# EasyEDA Pro project 通信+控制电路板.epro, schematic Schematic1
Board Name: Board1; Create Date: 2025-07-09; Page Name: P1; Project Name: 机器狗分电通信板; Schematic Name: Schematic1; Update Date: 2025-07-10; Company: 嘉立创EDA; Page Size: A4; Version: V1.0
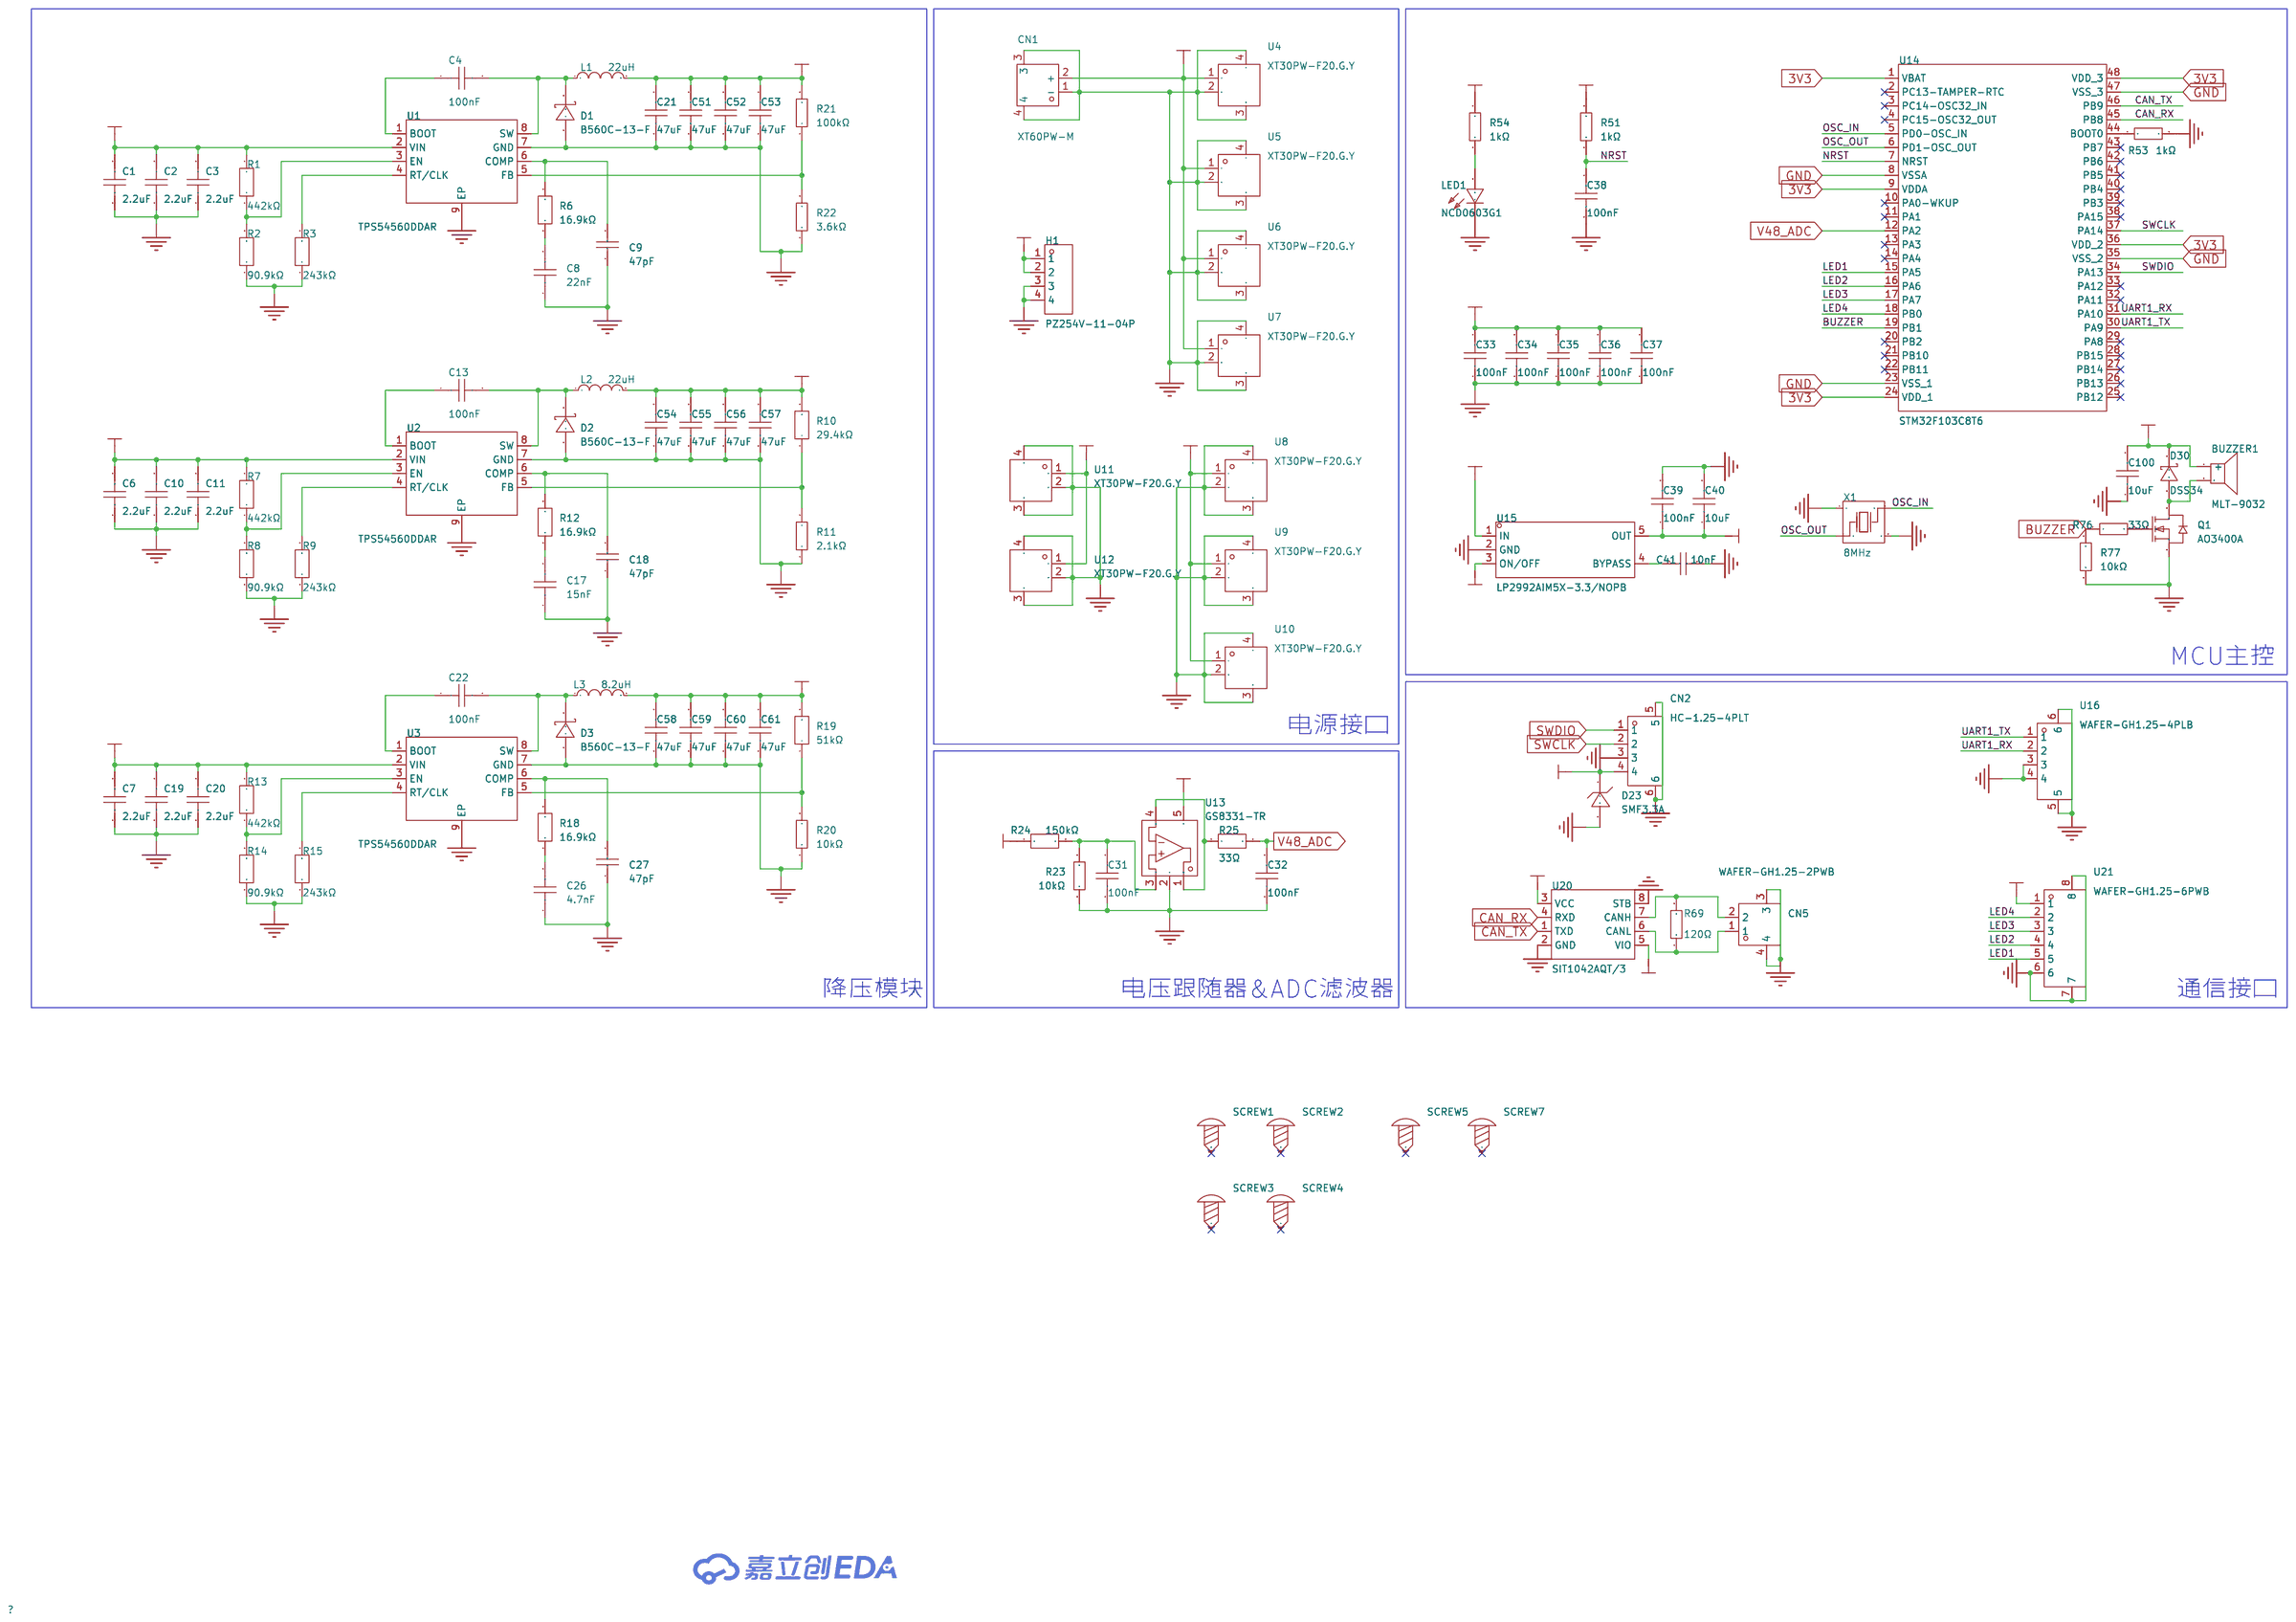
[diagram p0: schematic sheet]

## Parts
BUZZER1  MLT-9032  [BUZ-SMD_MLT-9032]
C1  2.2uF  [C1206]
C2  2.2uF  [C1206]
C3  2.2uF  [C1206]
C4  100nF  [C0603]
C6  2.2uF  [C1206]
C7  2.2uF  [C1206]
C8  22nF  [C0603]
C9  47pF  [C0603]
C10  2.2uF  [C1206]
C11  2.2uF  [C1206]
C13  100nF  [C0603]
C17  15nF  [C0603]
C18  47pF  [C0603]
C19  2.2uF  [C1206]
C20  2.2uF  [C1206]
C21  47uF  [C1206]
C22  100nF  [C0603]
C26  4.7nF  [C0603]
C27  47pF  [C0603]
C31  100nF  [C0603]
C32  100nF  [C0603]
C33  100nF  [C0603]
C34  100nF  [C0603]
C35  100nF  [C0603]
C36  100nF  [C0603]
C37  100nF  [C0603]
C38  100nF  [C0603]
C39  100nF  [C0603]
C40  10uF  [C0603]
C41  10nF  [C0603]
C51  47uF  [C1206]
C52  47uF  [C1206]
C53  47uF  [C1206]
C54  47uF  [C1206]
C55  47uF  [C1206]
C56  47uF  [C1206]
C57  47uF  [C1206]
C58  47uF  [C1206]
C59  47uF  [C1206]
C60  47uF  [C1206]
C61  47uF  [C1206]
C100  10uF  [C0603]
CN1  XT60PW-M  [CONN-TH_XT60PW-M]
CN2  HC-1.25-4PLT  [CONN-SMD_4P-P1.25_HCTL_HC-1.25-4PLT]
CN5  WAFER-GH1.25-2PWB  [CONN-TH_2P-P1.25_XUNPU_WAFER-GH1.25-2PWB]
D1  B560C-13-F  [SMC_L7.1-W6.2-LS8.1-RD]
D2  B560C-13-F  [SMC_L7.1-W6.2-LS8.1-RD]
D3  B560C-13-F  [SMC_L7.1-W6.2-LS8.1-RD]
D23  SMF3.3A  [SOD-123_L2.8-W1.8-LS3.7-RD]
D30  DSS34  [SOD-123FL_L2.7-W1.8-LS3.8-RD]
H1  PZ254V-11-04P  [HDR-TH_4P-P2.54-V-M]
L1  22uH  [IND-SMD_L10.7-W10.0_ETQP5MXXXX]
L2  22uH  [IND-SMD_L8.5-W8.0_XR0850]
L3  8.2uH  [IND-SMD_L7.0-W6.6_FXL0630]
LED1  NCD0603G1  [LED0603-RD_1]
Q1  AO3400A  [SOT-23_L2.9-W1.3-P1.90-LS2.4-BR]
R1  442kΩ  [R0603]
R2  90.9kΩ  [R0603]
R3  243kΩ  [R0603]
R6  16.9kΩ  [R0603]
R7  442kΩ  [R0603]
R8  90.9kΩ  [R0603]
R9  243kΩ  [R0603]
R10  29.4kΩ  [R0603]
R11  2.1kΩ  [R0603]
R12  16.9kΩ  [R0603]
R13  442kΩ  [R0603]
R14  90.9kΩ  [R0603]
R15  243kΩ  [R0603]
R18  16.9kΩ  [R0603]
R19  51kΩ  [R0603]
R20  10kΩ  [R0603]
R21  100kΩ  [R0603]
R22  3.6kΩ  [R0603]
R23  10kΩ  [R0603]
R24  150kΩ  [R0603]
R25  33Ω  [R0603]
R51  1kΩ  [R0603]
R53  1kΩ  [R0603]
R54  1kΩ  [R0603]
R69  120Ω  [R0603]
R76  33Ω  [R0603]
R77  10kΩ  [R0603]
SCREW1  -  [M2螺丝]
SCREW2  -  [M2螺丝]
SCREW3  -  [M2螺丝]
SCREW4  -  [M2螺丝]
SCREW5  -  [M2螺丝]
SCREW7  -  [M2螺丝]
U1  TPS54560DDAR  [SOP-8_L4.9-W3.9-P1.27-LS6.0-BL-EP-3]
U2  TPS54560DDAR  [SOP-8_L4.9-W3.9-P1.27-LS6.0-BL-EP-3]
U3  TPS54560DDAR  [SOP-8_L4.9-W3.9-P1.27-LS6.0-BL-EP-3]
U4  XT30PW-F20.G.Y  [CONN-TH_XT30PW-F-1]
U5  XT30PW-F20.G.Y  [CONN-TH_XT30PW-F-1]
U6  XT30PW-F20.G.Y  [CONN-TH_XT30PW-F-1]
U7  XT30PW-F20.G.Y  [CONN-TH_XT30PW-F-1]
U8  XT30PW-F20.G.Y  [CONN-TH_XT30PW-F-1]
U9  XT30PW-F20.G.Y  [CONN-TH_XT30PW-F-1]
U10  XT30PW-F20.G.Y  [CONN-TH_XT30PW-F-1]
U11  XT30PW-F20.G.Y  [CONN-TH_XT30PW-F-1]
U12  XT30PW-F20.G.Y  [CONN-TH_XT30PW-F-1]
U13  GS8331-TR  [SOT-23-5_L3.0-W1.7-P0.95-LS2.8-BL]
U14  STM32F103C8T6  [LQFP-48_L7.0-W7.0-P0.50-LS9.0-BL]
U15  LP2992AIM5X-3.3/NOPB  [SOT-23-5_L3.0-W1.7-P0.95-LS2.8-BR]
U16  WAFER-GH1.25-4PLB  [CONN-SMD_4P-P1.25_XUNPU_WAFER-GH1.25-4PLB]
U20  SIT1042AQT/3  [SOIC-8_L4.9-W3.9-P1.27-LS6.0-BL]
U21  WAFER-GH1.25-6PWB  [CONN-SMD_6P-P1.25_XUNPU_WAFER-GH1.25-6PWB]
X1  8MHz  [CRYSTAL-SMD_4P-L3.2-W2.5-BL]

## Library data of the parts
BUZZER1 = MLT-9032: Supplier Part: C194480; Manufacturer: 华能; JLCPCB Part Class: 扩展库; Datasheet: https://atta.szlcsc.com/upload/public/pdf/source/20231110/88E349EFBF67C090826D552D99A009CF.pdf; Supplier: LCSC
C1-C3 C6 C7 C10 C11 C19 C20 = CC1206KKX7R0BB225: 容值:2.2uF;精度:±10%;额定电压:100V;材质(温度系数):X7R;; LCSC Part Name: 2.2uF ±10% 100V; Supplier Part: C577211; Manufacturer: YAGEO(国巨); Supplier Footprint: 1206; JLCPCB Part Class: 扩展库; Datasheet: https://atta.szlcsc.com/upload/public/pdf/source/20211215/54859EBD0B88AE2AE5A42330F12918A3.pdf; Supplier: LCSC; Tolerance: ±10%; Voltage Rated: 100V; Temperature Coefficient: X7R
C4 C13 C22 = CGA0603X7R104K500JT: 容值:100nF;精度:±10%;额定电压:50V;温度系数:X7R;; LCSC Part Name: 100nF ±10% 50V; Supplier Part: C6119867; Manufacturer: HRE(芯声); Supplier Footprint: 0603; JLCPCB Part Class: 扩展库; Datasheet: https://atta.szlcsc.com/upload/public/pdf/source/20250103/C44077DA9E7B3EFAE02F22B6D3D1CBC9.pdf; Supplier: LCSC; Tolerance: ±10%; Voltage Rating: 50V; Temperature Coefficient: X7R
C8 C17 C26 = CGA0603X7R472K500JT: 容值:4.7nF;精度:±10%;额定电压:50V;温度系数:X7R;; LCSC Part Name: 4.7nF ±10% 50V; Supplier Part: C7503499; Manufacturer: HRE(芯声); Supplier Footprint: 0603; JLCPCB Part Class: 扩展库; Supplier: LCSC; Tolerance: ±10%; Voltage Rating: 50V; Temperature Coefficient: X7R
C9 C18 C27 = CC0603JRNPO9BN470: 容值:47pF;精度:±5%;额定电压:50V;材质(温度系数):NP0;; LCSC Part Name: 47pF ±5% 50V; Supplier Part: C105622; Manufacturer: YAGEO(国巨); Supplier Footprint: 0603; JLCPCB Part Class: 扩展库; Datasheet: https://atta.szlcsc.com/upload/public/pdf/source/20170505/1493957838062.pdf; Supplier: LCSC; Tolerance: ±5%; Voltage Rated: 50V; Temperature Coefficient: NP0
C21 C51-C61 = HGC1206R5476M250NSPJ: 容值:47uF;精度:±20%;额定电压:25V;温度系数:X5R;; LCSC Part Name: 47uF ±20% 25V; Supplier Part: C22367835; Manufacturer: Chinocera(华瓷); Supplier Footprint: 1206; JLCPCB Part Class: 扩展库; Datasheet: https://atta.szlcsc.com/upload/public/pdf/source/20240326/E6CB0DC43BB858B74F4352229FABFDCA.pdf; Supplier: LCSC; Tolerance: ±20%; Voltage Rating: 25V; Temperature Coefficient: X5R
C31-C39 = CC0603KRX7R9BB104: 容值:100nF;精度:±10%;额定电压:50V;温度系数:X7R;; LCSC Part Name: 100nF ±10% 50V; Supplier Part: C14663; Manufacturer: YAGEO(国巨); Supplier Footprint: 0603; JLCPCB Part Class: 基础库; Datasheet: https://atta.szlcsc.com/upload/public/pdf/source/20180910/C282072_33301C7F631E79921B82A8DAC6BCC5B3.pdf; Supplier: LCSC; Tolerance: ±10%; Voltage Rating: 50V; Temperature Coefficient: X7R
C40 = CGA0603X5R106K100JT: 容值:10uF;精度:±10%;额定电压:10V;温度系数:X5R;; LCSC Part Name: 10uF ±10% 10V; Supplier Part: C6119842; Manufacturer: HRE(芯声); Supplier Footprint: 0603; JLCPCB Part Class: 扩展库; Supplier: LCSC; Tolerance: ±10%; Voltage Rating: 10V; Temperature Coefficient: X5R
C41 = CC0603KRX7R9BB103: 容值:10nF;精度:±10%;额定电压:50V;材质(温度系数):X7R;; LCSC Part Name: 10nF ±10% 50V; Supplier Part: C100042; Manufacturer: YAGEO(国巨); Supplier Footprint: 0603; JLCPCB Part Class: 扩展库; Datasheet: https://atta.szlcsc.com/upload/public/pdf/source/20181008/C309510_22F155564471FAF6A489F7D68F34234E.pdf; Supplier: LCSC; Tolerance: ±10%; Voltage Rated: 50V; Temperature Coefficient: X7R
C100 = CGA0603X5R106K100JT: 容值:10uF;精度:±10%;额定电压:10V;温度系数:X5R;; LCSC Part Name: 10uF ±10% 10V; Supplier Part: C6119842; Manufacturer: HRE(芯声); Supplier Footprint: 0603; JLCPCB Part Class: 扩展库; Supplier: LCSC; Tolerance: ±10%; Voltage Rating: 10V; Temperature Coefficient: X5R; Voltage Rated: 10V
CN1 = XT60PW-M: 类别:-;类型1:-;; LCSC Part Name: AMASS(艾迈斯)航模插头xt60连接器150公母对接pw锂电池公头 板插卧式XT60PW-M; Supplier Part: C98732; Manufacturer: AMASS(艾迈斯); JLCPCB Part Class: 扩展库; Datasheet: https://atta.szlcsc.com/upload/public/pdf/source/20240118/44A3DCFF53BE25DC65378AFFB21277A4.pdf; Supplier: LCSC; Type: 卧式插头; Colour: 黄色; InterfaceType: 公头
CN2 = HC-1.25-4PLT: 插针结构:1x4P;间距:1.25mm;安装方式:立贴;参考系列:PicoBlade(MX 1.25);总PIN数:4P;排数:1;每排PIN数:4;行距:-;额定电流:2A;触头材质:黄铜;触头镀层:锡;工作温度范围:-25℃~+85℃;; LCSC Part Name: 1x4P 间距:1.25mm 立贴 系列:PicoBlade(MX 1.25); Supplier Part: C2845390; Manufacturer: HCTL(华灿天禄); Supplier Footprint: SMD,P=1.25mm; JLCPCB Part Class: 扩展库; Datasheet: https://atta.szlcsc.com/upload/public/pdf/source/20230707/8E5913B5A3195C18F5EE12EA4CB86B82.pdf; Supplier: LCSC; Pins Structure: 1x4P; Pitch: 1.25mm; Mounting Style: 立贴; Reference Series: PicoBlade(MX 1.25); Number of Pins: 4P; Number of Rows: 1; Number of PINs Per Row: 4; Current Rating (Max): 2A; Contact Material: 黄铜; Contact Plating: 锡; Operating Temperature Range: -25℃~+85℃; Rated Voltage (Max): 250V; Plastic Material: LCP; Flame Retardant Rating: UL94V-0; Supplementary Features: 辅助焊脚; Z-Height of the Board: 4.75mm; X-Length of Bottom Edge on Board (Spacing Line): 9.8mm; Y-Width of Bottom Edge on Board: 4.2mm
CN5 = WAFER-GH1.25-2PWB: 插针结构:1x2P;间距:1.25mm;安装方式:卧贴;参考系列:GH;总PIN数:2P;排数:1;每排PIN数:2;行距:-;额定电流:1A;触头材质:黄铜;触头镀层:-;工作温度范围:-25℃~+85℃;; LCSC Part Name: 1x2P 间距:1.25mm 卧贴 系列:GH; Supplier Part: C3029377; Manufacturer: XUNPU(讯普); Supplier Footprint: SMD,P=1.25mm,卧贴; JLCPCB Part Class: 扩展库; Datasheet: https://atta.szlcsc.com/upload/public/pdf/source/20220527/CB8773BFB0913C3B8ABD62CB38BA101A.pdf; Supplier: LCSC; Pins Structure: 1x2P; Pitch: 1.25mm; Mounting Type: 卧贴; Reference Series: GH; Number of Pins: 2P; Number of Rows: 1; Number of PINs Per Row: 2; Current Rating: 1A; Contact Material: 黄铜; Operating Temperature: -25℃~+85℃; Voltage Rating: 125V; Plastic Material: LCP; Supplementary Features: 辅助焊脚; Color: 米色; Z-Height of the Board: 4.35mm; X-Length of Bottom Edge on Board (Spacing Line): 5.75mm; Y-Width of Bottom Edge on Board: 5mm
D1-D3 = B560C-13-F: 正向压降(Vf):700mV@5A;直流反向耐压(Vr):60V;整流电流:5A;; LCSC Part Name: 电压:60V 电流:5A; Supplier Part: C85100; Manufacturer: DIODES(美台); Supplier Footprint: SMC(DO-214AB); JLCPCB Part Class: 扩展库; Datasheet: https://atta.szlcsc.com/upload/public/pdf/source/20171023/C134461_15087453602301052556.pdf; Supplier: LCSC; Forward Voltage (Vf@If): 700mV@5A; Reverse Voltage (Vr): 60V; Rectified Current: 5A; Reverse Leakage Current (Ir): 500uA@60V
D23 = SMF3.3A_C283866: 反向截止电压(Vrwm):3.3V;最大钳位电压:8V;峰值脉冲电流(Ipp)@10/1000us:25A;击穿电压:5.2V;; Supplier Part: C283866; Manufacturer: DOWO(东沃); Supplier Footprint: SOD-123FL; JLCPCB Part Class: 扩展库; Datasheet: https://atta.szlcsc.com/upload/public/pdf/source/20240321/1BA336232F2D97E4B026619682DB80D3.pdf; Supplier: LCSC; Reverse Stand-Off Voltage (Vrwm): 3.3V; Maximum Clamping Voltage: 8V; Peak Pulse Current (Ipp)@10/1000us: 25A; Breakdown Voltage: 5.2V; Reverse Leakage Current (Ir): 600uA; Type: TVS
D30 = DSS34_C511866: 正向压降(Vf):550mV@3A;直流反向耐压(Vr):40V;整流电流:3A;; LCSC Part Name: 电压:40V 电流:3A; Supplier Part: C511866; Manufacturer: BORN(伯恩半导体); Supplier Footprint: SOD-123FL; JLCPCB Part Class: 扩展库; Datasheet: https://atta.szlcsc.com/upload/public/pdf/source/20231213/A35D7F17905BC063B6E854915CEDE7F7.pdf; Supplier: LCSC; Forward Voltage (Vf@If): 550mV@3A; Reverse Voltage (Vr): 40V; Rectified Current: 3A
H1 = PZ254V-11-04P: 插针结构:1x4P;间距:2.54mm;行距:-;圆针/方针:方针;安装类型:直插;排数:单排;总PIN位数:4P;额定电流:3A;额定电压:250V;配合针长度:6mm;塑高:2.5mm;端接针长度:3mm;触头材质:-;工作温度范围:-40℃~+105℃;颜色:黑色;; LCSC Part Name: 间距:2.54mm 1x4P 直插 方针; Supplier Part: C2691448; Manufacturer: XFCN(兴飞); Supplier Footprint: 插件,P=2.54mm; JLCPCB Part Class: 扩展库; Datasheet: https://atta.szlcsc.com/upload/public/pdf/source/20200309/C492403_F9F19131791D08044AD4F84F8E751A34.pdf; Supplier: LCSC; Pin Structure: 1x4P; Pitch: 2.54mm; Circluar Pins/Square Pins: 方针; Mounting Type: 直插; Number of Rows: 单排; Number of Pins: 4P; Current Rating (Max): 3A; Voltage Rating (Max): 250V; Length of Mating Pin: 6mm; Insulation Height: 2.5mm; Length of End Connection Pin: 3mm; Operating Temperature Range: -40℃~+105℃; Color: 黑色
L1 = ETQP5M220YFC: 电感值:22uH;精度:±20%;额定电流:5.2A;饱和电流(Isat):8.8A;类型:一体成型电感;; LCSC Part Name: 22uH ±20% 8.8A; Supplier Part: C409633; Manufacturer: PANASONIC(松下); Supplier Footprint: SMD,10.7x10mm; JLCPCB Part Class: 扩展库; Datasheet: https://atta.szlcsc.com/upload/public/pdf/source/20190806/C409633_A24DBB89846E72786399C70D6ADBEB8A.pdf; Supplier: LCSC; Tolerance: ±20%; Rated Current: 5.2A; Saturation Current (Isat): 8.8A; DC Resistance (DCR): 45mΩ; Type: 一体成型电感; Ratings: AEC-Q200
L2 = CPX0850-220M-AG(22UH): 电感值:22uH;精度:±20%;额定电流:4.5A;饱和电流(Isat):6.5A;类型:一体成型电感;; LCSC Part Name: 22uH ±20% 6.5A; Supplier Part: C7461739; Manufacturer: DMBJ(振宝佳); Supplier Footprint: SMD,D8.5xL8.0mm; JLCPCB Part Class: Extended Part; Datasheet: https://atta.szlcsc.com/upload/public/pdf/source/20230706/0E85B4C70C3BF12A3691AC2C75FD94BE.pdf; Supplier: LCSC; Tolerance: ±20%; Current Rating: 4.5A; Current - Saturation(Isat): 6.5A; DC Resistance(DCR): 82mΩ; Type: 一体成型电感
L3 = FXL0630-8R2-M: 电感值:8.2uH;精度:±20%;额定电流:5A;饱和电流(Isat):6A;类型:一体成型电感;; LCSC Part Name: 8.2uH ±20% 6A; Supplier Part: C167222; Manufacturer: cjiang(长江微电); Supplier Footprint: SMD,6.6x7mm; JLCPCB Part Class: 扩展库; Datasheet: https://atta.szlcsc.com/upload/public/pdf/source/20240426/3189EA8206330E2108542F9E34E540E7.pdf; Supplier: LCSC; Tolerance: ±20%; Rated Current: 5A; Saturation Current (Isat): 6A; DC Resistance (DCR): 60mΩ; Type: 一体成型电感
LED1 = NCD0603G1: 发光颜色:翠绿色;正向压降(Vf):2.6V~3.6V;功率:72mW;正向电流:20mA;波长:515nm~530nm;透镜颜色:-;发光强度:330mcd~900mcd;发光角度:130°;工作温度:-30℃~+85℃;; Supplier Part: C84267; Manufacturer: 国星光电; Supplier Footprint: 0603; JLCPCB Part Class: 扩展库; Datasheet: https://atta.szlcsc.com/upload/public/pdf/source/20200820/C84267_04BA7703640BAC111D09F5EFB971FBF3.pdf; Supplier: LCSC; Illumination Color: 翠绿色; Voltage - Forward(Vf): 2.6V~3.6V; Power(Watts): 72mW; Forward Current: 20mA; Wavelength - Dominant: 515nm~530nm; Luminous Intensity: 330mcd~900mcd; Viewing Angle: 130°; Operating Temperature: -30℃~+85℃
Q1 = AO3400A_C344010: 类型:1个N沟道;漏源电压(Vdss):30V;连续漏极电流(Id):5.8A;导通电阻(RDS(on)@Vgs,Id):32mΩ@10V,5.8A;功率(Pd):1.4W;阈值电压(Vgs(th)@Id):1.4V@250uA;; LCSC Part Name: 1个N沟道 耐压:30V 电流:5.8A; Supplier Part: C344010; Manufacturer: BORN(伯恩半导体); Supplier Footprint: SOT-23; JLCPCB Part Class: 扩展库; Datasheet: https://atta.szlcsc.com/upload/public/pdf/source/20181211/C344010_1A88330921524F88534EF594457919E8.pdf; Supplier: LCSC; Type: 1个N沟道; Drain Source Voltage (Vdss): 30V; Continuous Drain Current (Id): 5.8A; Drain Source On Resistance (RDS(on)@Vgs,Id): 32mΩ@10V,5.8A; Power Dissipation (Pd): 1.4W; Gate Threshold Voltage (Vgs(th)@Id): 1.4V@250uA; Input Capacitance (Ciss@Vds): 823pF@15V; Operating Temperature: -55℃~+150℃
R1 R7 R13 = FRH0603D4423TS: 电阻类型:厚膜电阻;阻值:442kΩ;精度:±0.5%;功率:100mW;最大工作电压:75V;温度系数:±100ppm/℃;; LCSC Part Name: 442kΩ ±0.5% 100mW 厚膜电阻; Supplier Part: C3013343; Manufacturer: FOJAN(富捷); Supplier Footprint: 0603; JLCPCB Part Class: 扩展库; Datasheet: https://atta.szlcsc.com/upload/public/pdf/source/20211221/925EC7D7225764EE0046F22065062C87.pdf; Supplier: LCSC; Type: 厚膜电阻; Tolerance: ±0.5%; Power(Watts): 100mW; Overload Voltage (Max): 75V; Temperature Coefficient: ±100ppm/℃
R2 R8 R14 = FRC0603F9092TS: 电阻类型:厚膜电阻;阻值:90.9kΩ;精度:±1%;功率:100mW;工作电压:75V;温度系数:±100ppm/℃;; LCSC Part Name: 90.9kΩ ±1% 100mW 厚膜电阻; Supplier Part: C2930136; Manufacturer: FOJAN(富捷); Supplier Footprint: 0603; JLCPCB Part Class: 扩展库; Datasheet: https://atta.szlcsc.com/upload/public/pdf/source/20211221/925EC7D7225764EE0046F22065062C87.pdf; Supplier: LCSC; Type: 厚膜电阻; Tolerance: ±1%; Power(Watts): 100mW; Voltage-Supply(Max): 75V; Temperature Coefficient: ±100ppm/℃; Operating Temperature: -55℃~+155℃
R3 R9 R15 = FRC0603F2433TS: 电阻类型:厚膜电阻;阻值:243kΩ;精度:±1%;功率:100mW;温度系数:±100ppm/℃;; LCSC Part Name: 厚膜电阻 243kΩ ±1% 100mW; Supplier Part: C7467321; Manufacturer: FOJAN(富捷); Supplier Footprint: 0603; JLCPCB Part Class: 扩展库; Datasheet: https://atta.szlcsc.com/upload/public/pdf/source/20211221/9022FBEBBD509006A57EBC43C1F2F40C.pdf; Supplier: LCSC; Type: 厚膜电阻; Tolerance: ±1%; Power(Watts): 100mW; Temperature Coefficient: ±100ppm/℃
R6 R12 R18 = FRC0603F1692TS: 电阻类型:厚膜电阻;阻值:16.9kΩ;精度:±1%;功率:100mW;工作电压:75V;温度系数:±100ppm/℃;; LCSC Part Name: 16.9kΩ ±1% 100mW 厚膜电阻; Supplier Part: C2933158; Manufacturer: FOJAN(富捷); Supplier Footprint: 0603; JLCPCB Part Class: 扩展库; Datasheet: https://atta.szlcsc.com/upload/public/pdf/source/20211221/925EC7D7225764EE0046F22065062C87.pdf; Supplier: LCSC; Type: 厚膜电阻; Tolerance: ±1%; Power(Watts): 100mW; Voltage-Supply(Max): 75V; Temperature Coefficient: ±100ppm/℃; Operating Temperature: -55℃~+155℃
R10 = FRC0603F2942TS: 电阻类型:厚膜电阻;阻值:29.4kΩ;精度:±1%;功率:100mW;工作电压:75V;温度系数:±100ppm/℃;; LCSC Part Name: 29.4kΩ ±1% 100mW 厚膜电阻; Supplier Part: C2930086; Manufacturer: FOJAN(富捷); Supplier Footprint: 0603; JLCPCB Part Class: 扩展库; Datasheet: https://atta.szlcsc.com/upload/public/pdf/source/20211221/925EC7D7225764EE0046F22065062C87.pdf; Supplier: LCSC; Type: 厚膜电阻; Tolerance: ±1%; Power(Watts): 100mW; Voltage-Supply(Max): 75V; Temperature Coefficient: ±100ppm/℃; Operating Temperature: -55℃~+155℃
R11 = RT0603BRD072K1L: 电阻类型:薄膜电阻;阻值:2.1kΩ;精度:±0.1%;功率:100mW;温度系数:±25ppm/℃;; LCSC Part Name: 薄膜电阻 2.1kΩ ±0.1% 100mW; Supplier Part: C861293; Manufacturer: YAGEO(国巨); Supplier Footprint: 0603; JLCPCB Part Class: 扩展库; Datasheet: https://atta.szlcsc.com/upload/public/pdf/source/20200610/C326738_5639A9F1B6EB6E4AE2197577D3456E7F.pdf; Supplier: LCSC; Type: 薄膜电阻; Tolerance: ±0.1%; Power(Watts): 100mW; Temperature Coefficient: ±25ppm/℃; Operating Temperature Range: -55℃~+155℃
R19 = FRC0603F5362TS: 电阻类型:厚膜电阻;阻值:53.6kΩ;精度:±1%;功率:100mW;最大工作电压:75V;温度系数:±100ppm/℃;; LCSC Part Name: 53.6kΩ ±1% 100mW 厚膜电阻; Supplier Part: C2930115; Manufacturer: FOJAN(富捷); Supplier Footprint: 0603; JLCPCB Part Class: 扩展库; Datasheet: https://atta.szlcsc.com/upload/public/pdf/source/20211221/925EC7D7225764EE0046F22065062C87.pdf; Supplier: LCSC; Type: 厚膜电阻; Tolerance: ±1%; Power(Watts): 100mW; Overload Voltage (Max): 75V; Temperature Coefficient: ±100ppm/℃; Operating Temperature Range: -55℃~+155℃
R20 = 0603WAF1002T5E: 电阻类型:厚膜电阻;阻值:10kΩ;精度:±1%;功率:100mW;工作电压:75V;温度系数:±100ppm/℃;; LCSC Part Name: 厚膜电阻 10kΩ ±1% 100mW; Supplier Part: C25804; Manufacturer: UNI-ROYAL(厚声); Supplier Footprint: 0603; JLCPCB Part Class: 基础库; Datasheet: https://atta.szlcsc.com/upload/public/pdf/source/20200306/C422600_1E6D84923E4A46A82E41ADD87F860B5C.pdf; Supplier: LCSC; Type: 厚膜电阻; Tolerance: ±1%; Power(Watts): 100mW; Voltage-Supply(Max): 75V; Temperature Coefficient: ±100ppm/℃; Operating Temperature: -55℃~+155℃
R21 = 0603WAF1003T5E: 电阻类型:厚膜电阻;阻值:100kΩ;精度:±1%;功率:100mW;最大工作电压:75V;温度系数:±100ppm/℃;; LCSC Part Name: 100kΩ ±1% 100mW 厚膜电阻; Supplier Part: C25803; Manufacturer: UNI-ROYAL(厚声); Supplier Footprint: 0603; JLCPCB Part Class: 基础库; Datasheet: https://atta.szlcsc.com/upload/public/pdf/source/20200306/C422600_1E6D84923E4A46A82E41ADD87F860B5C.pdf; Supplier: LCSC; Type: 厚膜电阻; Tolerance: ±1%; Power(Watts): 100mW; Overload Voltage (Max): 75V; Temperature Coefficient: ±100ppm/℃; Operating Temperature Range: -55℃~+155℃
R22 = 0603WAF3301T5E: 电阻类型:厚膜电阻;阻值:3.3kΩ;精度:±1%;功率:100mW;最大工作电压:75V;温度系数:±100ppm/℃;; LCSC Part Name: 3.3kΩ ±1% 100mW 厚膜电阻; Supplier Part: C22978; Manufacturer: UNI-ROYAL(厚声); Supplier Footprint: 0603; JLCPCB Part Class: 基础库; Datasheet: https://atta.szlcsc.com/upload/public/pdf/source/20200306/C422600_1E6D84923E4A46A82E41ADD87F860B5C.pdf; Supplier: LCSC; Type: 厚膜电阻; Tolerance: ±1%; Power(Watts): 100mW; Overload Voltage (Max): 75V; Temperature Coefficient: ±100ppm/℃; Operating Temperature Range: -55℃~+155℃
R23 = RT0603BRD0710KL: 电阻类型:薄膜电阻;阻值:10kΩ;精度:±0.1%;功率:100mW;最大工作电压:75V;温度系数:±25ppm/℃;; LCSC Part Name: 薄膜电阻 10kΩ ±0.1% 100mW; Supplier Part: C95204; Manufacturer: YAGEO(国巨); Supplier Footprint: 0603; JLCPCB Part Class: 扩展库; Datasheet: https://atta.szlcsc.com/upload/public/pdf/source/20170217/1487301593756.pdf; Supplier: LCSC; Type: 薄膜电阻; Tolerance: ±0.1%; Power(Watts): 100mW; Overload Voltage (Max): 75V; Temperature Coefficient: ±25ppm/℃; Operating Temperature Range: -55℃~+155℃
R24 = ERA3AEB154V: 电阻类型:薄膜电阻;阻值:150kΩ;精度:±0.1%;功率:100mW;最大工作电压:75V;温度系数:±25ppm/℃;; LCSC Part Name: 150kΩ ±0.1% 100mW 薄膜电阻; Supplier Part: C473258; Manufacturer: PANASONIC(松下); Supplier Footprint: 0603; JLCPCB Part Class: 扩展库; Datasheet: https://atta.szlcsc.com/upload/public/pdf/source/20200407/C473258_86C691EA00C291CD14859B4B15974633.pdf; Supplier: LCSC; Type: 薄膜电阻; Tolerance: ±0.1%; Power(Watts): 100mW; Overload Voltage (Max): 75V; Temperature Coefficient: ±25ppm/℃; Operating Temperature Range: -55℃~+155℃
R25 = FRC0603F33R0TS: 电阻类型:厚膜电阻;阻值:33Ω;精度:±1%;功率:100mW;最大工作电压:75V;温度系数:±100ppm/℃;; LCSC Part Name: 33Ω ±1% 100mW 厚膜电阻; Supplier Part: C2909394; Manufacturer: FOJAN(富捷); Supplier Footprint: 0603; JLCPCB Part Class: 扩展库; Datasheet: https://atta.szlcsc.com/upload/public/pdf/source/20211221/925EC7D7225764EE0046F22065062C87.pdf; Supplier: LCSC; Type: 厚膜电阻; Tolerance: ±1%; Power(Watts): 100mW; Overload Voltage (Max): 75V; Temperature Coefficient: ±100ppm/℃; Operating Temperature Range: -55℃~+155℃
R51 R53 R54 = 0603WAF1001T5E: 电阻类型:厚膜电阻;阻值:1kΩ;精度:±1%;功率:100mW;最大工作电压:75V;温度系数:±100ppm/℃;; LCSC Part Name: 1kΩ ±1% 100mW 厚膜电阻; Supplier Part: C21190; Manufacturer: UNI-ROYAL(厚声); Supplier Footprint: 0603; JLCPCB Part Class: 基础库; Datasheet: https://atta.szlcsc.com/upload/public/pdf/source/20200306/C422600_1E6D84923E4A46A82E41ADD87F860B5C.pdf; Supplier: LCSC; Type: 厚膜电阻; Tolerance: ±1%; Power(Watts): 100mW; Overload Voltage (Max): 75V; Temperature Coefficient: ±100ppm/℃; Operating Temperature Range: -55℃~+155℃
R69 = 0603WAF1200T5E: 电阻类型:厚膜电阻;阻值:120Ω;精度:±1%;功率:100mW;最大工作电压:75V;温度系数:±100ppm/℃;; LCSC Part Name: 120Ω ±1% 100mW 厚膜电阻; Supplier Part: C22787; Manufacturer: UNI-ROYAL(厚声); Supplier Footprint: 0603; JLCPCB Part Class: 基础库; Datasheet: https://atta.szlcsc.com/upload/public/pdf/source/20200306/C422600_1E6D84923E4A46A82E41ADD87F860B5C.pdf; Supplier: LCSC; Type: 厚膜电阻; Tolerance: ±1%; Power(Watts): 100mW; Overload Voltage (Max): 75V; Temperature Coefficient: ±100ppm/℃; Operating Temperature Range: -55℃~+155℃
R76 = 0603WAF330JT5E: 电阻类型:厚膜电阻;阻值:33Ω;精度:±1%;功率:100mW;最大工作电压:75V;温度系数:±100ppm/℃;; LCSC Part Name: 33Ω ±1% 100mW 厚膜电阻; Supplier Part: C23140; Manufacturer: UNI-ROYAL(厚声); Supplier Footprint: 0603; JLCPCB Part Class: 基础库; Datasheet: https://atta.szlcsc.com/upload/public/pdf/source/20200306/C422600_1E6D84923E4A46A82E41ADD87F860B5C.pdf; Supplier: LCSC; Type: 厚膜电阻; Tolerance: ±1%; Power(Watts): 100mW; Overload Voltage (Max): 75V; Temperature Coefficient: ±100ppm/℃; Operating Temperature Range: -55℃~+155℃
R77 = 0603WAF1002T5E: 电阻类型:厚膜电阻;阻值:10kΩ;精度:±1%;功率:100mW;工作电压:75V;温度系数:±100ppm/℃;; LCSC Part Name: 厚膜电阻 10kΩ ±1% 100mW; Supplier Part: C25804; Manufacturer: UNI-ROYAL(厚声); Supplier Footprint: 0603; JLCPCB Part Class: 基础库; Datasheet: https://atta.szlcsc.com/upload/public/pdf/source/20200306/C422600_1E6D84923E4A46A82E41ADD87F860B5C.pdf; Supplier: LCSC; Type: 厚膜电阻; Tolerance: ±1%; Power(Watts): 100mW; Voltage-Supply(Max): 75V; Temperature Coefficient: ±100ppm/℃; Operating Temperature: -55℃~+155℃; Overload Voltage (Max): 75V; Operating Temperature Range: -55℃~+155℃
SCREW1-SCREW5 SCREW7 = M2螺丝: Supplier Footprint: 插件
U1-U3 = TPS54560DDAR_C7420431: 功能类型:降压型;输出类型:可调;工作电压:4.5V~60V;输出电压:800mV~57V;输出电流:5A;; LCSC Part Name: 4.5V-60V输入，5A输出，高效降压DC-DC转换器; Supplier Part: C7420431; Manufacturer: Tokmas(托克马斯); Supplier Footprint: SOP-8-EP; JLCPCB Part Class: 扩展库; Datasheet: https://atta.szlcsc.com/upload/public/pdf/source/20230612/0697A5E7B050616939B6E65FB5217F67.pdf; Supplier: LCSC; Function: 降压型; Output Type: 可调; Voltage - Supply: 4.5V~60V; Output Voltage: 800mV~57V; Output Current: 5A; Frequency - Switching: 450kHz; Operating Temperature: -40℃~+125℃@(TJ); Synchronous Rectifier: 否; Number of Outputs: 1; Topology: 降压式；反相式; Quiescent Current: 175uA; Switch tube (built-in/external): 内置
U4-U12 = XT30PW-F20.G.Y: 类别:-;类型1:-;; LCSC Part Name: AMASS(艾迈斯)电源连接器 母头 XT30PW-F; Supplier Part: C2913282; Manufacturer: AMASS(艾迈斯); JLCPCB Part Class: 扩展库; Datasheet: https://atta.szlcsc.com/upload/public/pdf/source/20231218/06CFCF98887A9A87638B0856A725C8FD.pdf; Supplier: LCSC; Type: 航模插头; InterfaceType: 母头
U13 = GS8331-TR: 放大器数:单路;增益带宽积(GBP):350kHz;压摆率(SR):0.2V/us;; LCSC Part Name: GS8331 SOT-23-5; Supplier Part: C157712; Manufacturer: Gainsil(聚洵); Supplier Footprint: SOT-23-5; JLCPCB Part Class: 扩展库; Datasheet: https://atta.szlcsc.com/upload/public/pdf/source/20200615/C605419_D70E1851DA800D34ADA08E397521FED7.pdf; Supplier: LCSC; Number of Circuits: 单路; Gain Bandwidth Product(GBP): 350kHz; Slew Rate(SR): 0.2V/us; Supply Voltage: 2.1V~5.5V; Supply Current: 20uA; Operating Temperature: -40℃~+125℃
U14 = STM32F103C8T6: CPU内核:ARM-M3;CPU最大主频:72MHz;应用领域:-;; LCSC Part Name: 主流增强型ARM Cortex-M3 MCU，具有64 KB Flash、72 MHz CPU、电机控制、USB和CAN; Supplier Part: C8734; Manufacturer: ST(意法半导体); Supplier Footprint: LQFP-48(7x7); JLCPCB Part Class: 扩展库; Datasheet: https://atta.szlcsc.com/upload/public/pdf/source/20220812/8363ACEC51AD55ECEB84799464F7CB85.pdf; Supplier: LCSC; CPU Core: ARM-M3; CPU Maximum Speed: 72MHz; Program Storage Size: 64KB; Program Memory Type: FLASH; Number of I/O: 37; ADC (Bit): 12bit; Voltage - Supply: 2V~3.6V
U15 = LP2992AIM5X-3.3/NOPB: 输出类型:固定;最大输入电压:16V;输出电压:3.3V;输出电流:250mA;电源纹波抑制比(PSRR):45dB@(1kHz);输出极性:正极;; LCSC Part Name: 具有使能功能的 250mA、16V、低压降稳压器; Supplier Part: C111076; Manufacturer: TI(德州仪器); Supplier Footprint: SOT-23-5; JLCPCB Part Class: 扩展库; Datasheet: https://www.ti.com/cn/lit/gpn/lp2992; Supplier: LCSC; Output Type: 固定; Maximum Input Voltage: 16V; Output Voltage: 3.3V; Output Current: 250mA; Power Supply Rejection Ratio (PSRR): 45dB@(1kHz); Dropout Voltage: 850mV@(250mA); standby current: 95uA; Feature: 防静电保护；短路保护；低ESR；热保护(TSD)；过流保护(OCP)；带使能; Operating Temperature: -40℃~+125℃; Output Polarity: 正极; Number of Outputs: 1
U16 = WAFER-GH1.25-4PLB: 插针结构:1x4P;间距:1.25mm;安装方式:立贴;参考系列:GH;总PIN数:4P;排数:1;每排PIN数:4;行距:-;额定电流:1A;触头材质:黄铜;触头镀层:-;工作温度范围:-25℃~+85℃;; LCSC Part Name: 1x4P 间距:1.25mm 立贴 系列:GH; Supplier Part: C3029370; Manufacturer: XUNPU(讯普); Supplier Footprint: SMD,P=1.25mm; JLCPCB Part Class: 扩展库; Datasheet: https://atta.szlcsc.com/upload/public/pdf/source/20220527/44F824AAC8C2B617205E15955FF9C23D.pdf; Supplier: LCSC; Pins Structure: 1x4P; Pitch: 1.25mm; Mounting Type: 立贴; Reference Series: GH; Number of Pins: 4P; Number of Rows: 1; Number of PINs Per Row: 4; Current Rating: 1A; Contact Material: 黄铜; Operating Temperature: -25℃~+85℃; Voltage Rating: 125V; Plastic Material: LCP; Supplementary Features: 辅助焊脚; Color: 米色; Z-Height of the Board: 4.2mm; X-Length of Bottom Edge on Board (Spacing Line): 8.25mm; Y-Width of Bottom Edge on Board: 4.95mm
U20 = SIT1042AQT/3: 类型:CAN-FD收发器;数据速率:5Mbps;; Supplier Part: C5382542; Manufacturer: SIT(芯力特); Supplier Footprint: SOP-8; JLCPCB Part Class: 扩展库; Datasheet: https://atta.szlcsc.com/upload/public/pdf/source/20240906/D3430A363AE1D9ADB7ADD9C550EC5EB2.pdf; Supplier: LCSC; Type: CAN-FD收发器; Data Rate: 5Mbps; Supply Voltage: 4.5V~5.5V
U21 = WAFER-GH1.25-6PWB: 插针结构:1x6P;间距:1.25mm;安装方式:卧贴;参考系列:GH;总PIN数:6P;排数:1;每排PIN数:6;行距:-;额定电流:1A;触头材质:黄铜;触头镀层:-;工作温度范围:-25℃~+85℃;; LCSC Part Name: 1x6P 间距:1.25mm 卧贴 系列:GH; Supplier Part: C3029381; Manufacturer: XUNPU(讯普); Supplier Footprint: SMD,P=1.25mm,卧贴; JLCPCB Part Class: 扩展库; Datasheet: https://atta.szlcsc.com/upload/public/pdf/source/20220527/CB8773BFB0913C3B8ABD62CB38BA101A.pdf; Supplier: LCSC; Pins Structure: 1x6P; Pitch: 1.25mm; Mounting Type: 卧贴; Reference Series: GH; Number of Pins: 6P; Number of Rows: 1; Number of PINs Per Row: 6; Current Rating: 1A; Contact Material: 黄铜; Operating Temperature: -25℃~+85℃; Voltage Rating: 125V; Plastic Material: LCP; Supplementary Features: 辅助焊脚; Color: 米色; Z-Height of the Board: 4.35mm; X-Length of Bottom Edge on Board (Spacing Line): 10.75mm; Y-Width of Bottom Edge on Board: 5mm
X1 = TAXM8M4RDBCCT2T: 晶振类型:贴片晶振;频率:8MHz;常温频差:±10ppm;负载电容:10pF;频率稳定度:±15ppm;; LCSC Part Name: 8MHz ±10ppm 10pF; Supplier Part: C400090; Manufacturer: YJX(雅晶鑫); Supplier Footprint: SMD3225-4P; JLCPCB Part Class: 扩展库; Datasheet: https://atta.szlcsc.com/upload/public/pdf/source/20190626/C400090_CF95B89E745AFE4EF2E392EF8AC009D6.pdf; Supplier: LCSC; Type: 贴片晶振; Normal temperature Frequency Tolerance: ±10ppm; Load Capacitance: 10pF; Frequency Stability: ±15ppm; Equivalent Series Resistance(ESR): 250Ω; Operating Temperature: -40℃~+85℃

## Nets
3V3: C33.2 C34.2 C35.2 C36.2 C37.2 C39.1 C40.1 CN2.4 D23.1 R51.2 R54.2 U14.1(VBAT) U14.9(VDDA) U14.24(VDD_1) U14.36(VDD_2) U14.48(VDD_3) U15.5(OUT) U20.5(VIO)
5V: BUZZER1.1(+) C58.2 C59.2 C60.2 C61.2 C100.2 D30.1 H1.1 H1.2 L3.2 R19.2 U13.5(V+) U15.1(IN) U15.3(ON/OFF) U20.3(VCC)
12V: C54.2 C55.2 C56.2 C57.2 L2.2 R10.2 U11.1 U12.1 U21.1
24V: C21.2 C51.2 C52.2 C53.2 L1.2 R21.2 U8.1 U9.1 U10.1
48V: C1.2 C2.2 C3.2 C6.2 C7.2 C10.2 C11.2 C19.2 C20.2 CN1.2(+) R1.2 R7.2 R13.2 R24.1 U1.2(VIN) U2.2(VIN) U3.2(VIN) U4.1 U5.1 U6.1 U7.1
GND: C1.1 C2.1 C3.1 C6.1 C7.1 C8.1 C9.1 C10.1 C11.1 C17.1 C18.1 C19.1 C20.1 C21.1 C26.1 C27.1 C31.1 C32.1 C33.1 C34.1 C35.1 C36.1 C37.1 C38.1 C39.2 C40.2 C41.2 C51.1 C52.1 C53.1 C54.1 C55.1 C56.1 C57.1 C58.1 C59.1 C60.1 C61.1 C100.1 CN1.1(-) CN1.3 CN1.4 CN2.3 CN2.5 CN2.6 CN5.3 CN5.4 D1.2(A) D2.2(A) D3.2(A) D23.2 H1.3 H1.4 LED1.1(K) Q1.2(S) R2.1 R3.1 R8.1 R9.1 R11.1 R14.1 R15.1 R20.1 R22.1 R23.1 R53.1 R77.2 U1.7(GND) U1.9(EP) U2.7(GND) U2.9(EP) U3.7(GND) U3.9(EP) U4.2 U4.3 U4.4 U5.2 U5.3 U5.4 U6.2 U6.3 U6.4 U7.2 U7.3 U7.4 U8.2 U8.3 U8.4 U9.2 U9.3 U9.4 U10.2 U10.3 U10.4 U11.2 U11.3 U11.4 U12.2 U12.3 U12.4 U13.2(V-) U14.8(VSSA) U14.23(VSS_1) U14.35(VSS_2) U14.47(VSS_3) U15.2(GND) U16.3 U16.4 U16.5 U16.6 U20.2(GND) U20.8(STB) U21.6 U21.7 U21.8 X1.2 X1.4
V48_ADC: C32.2 R25.2 U14.12(PA2)
BUZZER: R76.1 R77.1 U14.19(PB1)
CAN_RX: U14.45(PB8) U20.4(RXD)
CAN_TX: U14.46(PB9) U20.1(TXD)
LED1: U14.15(PA5) U21.5
LED2: U14.16(PA6) U21.4
LED3: U14.17(PA7) U21.3
LED4: U14.18(PB0) U21.2
NRST: C38.2 R51.1 U14.7(NRST)
OSC_IN: U14.5(PD0-OSC_IN) X1.3
OSC_OUT: U14.6(PD1-OSC_OUT) X1.1
SWCLK: CN2.2 U14.37(PA14)
SWDIO: CN2.1 U14.34(PA13)
UART1_RX: U14.31(PA10) U16.2
UART1_TX: U14.30(PA9) U16.1
$1N640: R1.1 R2.2 U1.3(EN)
$1N771: R3.2 U1.4(RT/CLK)
$1N1086: C4.1 U1.1(BOOT)
$1N1094: C4.2 D1.1(K) L1.1 U1.8(SW)
$1N1713: C8.2 R6.1
$1N1785: C9.2 R6.2 U1.6(COMP)
$1N2645: R7.1 R8.2 U2.3(EN)
$1N2651: R9.2 U2.4(RT/CLK)
$1N2674: C13.1 U2.1(BOOT)
$1N2678: C13.2 D2.1(K) L2.1 U2.8(SW)
$1N2694: R10.1 R11.2 U2.5(FB)
$1N2698: C17.2 R12.1
$1N2700: C18.2 R12.2 U2.6(COMP)
$1N3482: R13.1 R14.2 U3.3(EN)
$1N3488: R15.2 U3.4(RT/CLK)
$1N3511: C22.1 U3.1(BOOT)
$1N3515: C22.2 D3.1(K) L3.1 U3.8(SW)
$1N3535: C26.2 R18.1
$1N3537: C27.2 R18.2 U3.6(COMP)
$1N4335: R21.1 R22.2 U1.5(FB)
$1N4383: R19.1 R20.2 U3.5(FB)
$1N6178: C31.2 R23.2 R24.2 U13.3(INA+)
$1N6526: R25.1 U13.1(OUTA) U13.4(INA-)
$1N8542: R53.2 U14.44(BOOT0)
$1N8650: LED1.2(A) R54.1
$1N9418: C41.1 U15.4(BYPASS)
$1N16834: BUZZER1.2 D30.2 Q1.3(D)
$1N16836: Q1.1(G) R76.2
$1N17651: CN5.2 R69.2 U20.7(CANH)
$1N17659: CN5.1 R69.1 U20.6(CANL)

Not connected (* = marked no-connect by the designer): SCREW1 1*; SCREW2 1*; SCREW3 1*; SCREW4 1*; SCREW5 1*; SCREW7 1*; U14 2(PC13-TAMPER-RTC)* 3(PC14-OSC32_IN)* 4(PC15-OSC32_OUT)* 10(PA0-WKUP)* 11(PA1)* 13(PA3)* 14(PA4)* 20(PB2)* 21(PB10)* 22(PB11)* 25(PB12)* 26(PB13)* 27(PB14)* 28(PB15)* 29(PA8)* 32(PA11)* 33(PA12)* 38(PA15)* 39(PB3)* 40(PB4)* 41(PB5)* 42(PB6)* 43(PB7)*

## Notes on the sheet
- MCU主控
- 电源接口
- 降压模块
- 电压跟随器&ADC滤波器
- 通信接口
